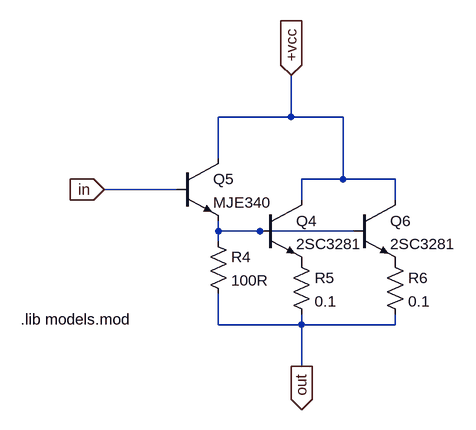
[diagram p0: schematic ss-trans-out-npn.asc]
ss-trans-out-npn.asc, the LTspice schematic file:
Version 4
SHEET 1 880 680
WIRE 208 -64 208 -128
WIRE 208 -64 96 -64
WIRE 288 -64 208 -64
WIRE 96 0 96 -64
WIRE 288 32 288 -64
WIRE 288 32 224 32
WIRE 368 32 288 32
WIRE 32 48 -80 48
WIRE 224 64 224 32
WIRE 368 64 368 32
WIRE 96 112 96 96
WIRE 160 112 96 112
WIRE 304 112 160 112
WIRE 96 128 96 112
WIRE 96 256 96 208
WIRE 224 256 224 240
WIRE 224 256 96 256
WIRE 320 256 224 256
WIRE 368 256 368 240
WIRE 368 256 320 256
WIRE 224 320 224 256
FLAG -80 48 in
IOPIN -80 48 In
FLAG 208 -128 +vcc
IOPIN 208 -128 In
FLAG 224 320 out
IOPIN 224 320 Out
DATAFLAG 320 256 "round($*100)/100"
DATAFLAG 320 256 "round($*100)/100"
SYMBOL npn 160 64 R0
SYMATTR InstName Q4
SYMATTR Value 2SC3281
SYMBOL npn 32 0 R0
SYMATTR InstName Q5
SYMATTR Value MJE340
SYMBOL res 80 112 R0
SYMATTR InstName R4
SYMATTR Value 100R
SYMBOL npn 304 64 R0
SYMATTR InstName Q6
SYMATTR Value 2SC3281
SYMBOL res 208 144 R0
SYMATTR InstName R5
SYMATTR Value 0.1
SYMBOL res 352 144 R0
SYMATTR InstName R6
SYMATTR Value 0.1
TEXT -208 248 Left 2 !.lib models.mod

The netlist it stands for:
* ss-trans-out-npn.asc
Q4 +vcc N001 P001 0 2SC3281
Q5 +vcc in N001 0 MJE340
R4 N001 out 100R
Q6 +vcc N001 P002 0 2SC3281
R5 P001 out 0.1
R6 P002 out 0.1
.model NPN NPN
.model PNP PNP
.lib standard.bjt
.lib models.mod
.backanno
.end